# Altium project copper_suicide.PrjPCB (part 4 of 5)

## Sheet con-left-top.SchDoc: CS - Left Top
size Letter; CheckedBy: J. Brinton; CompanyName: Signal Laboratories, Inc.; DrawnBy: J. Brinton; Engineer: J. Brinton; Address1: 3479 Edison Way; Address2: Menlo Park CA 94025; Address3: +1 (877) 778-8435; Address4: siglabs.com; Revision: 3; SheetNumber: 33; SheetTotal: 47
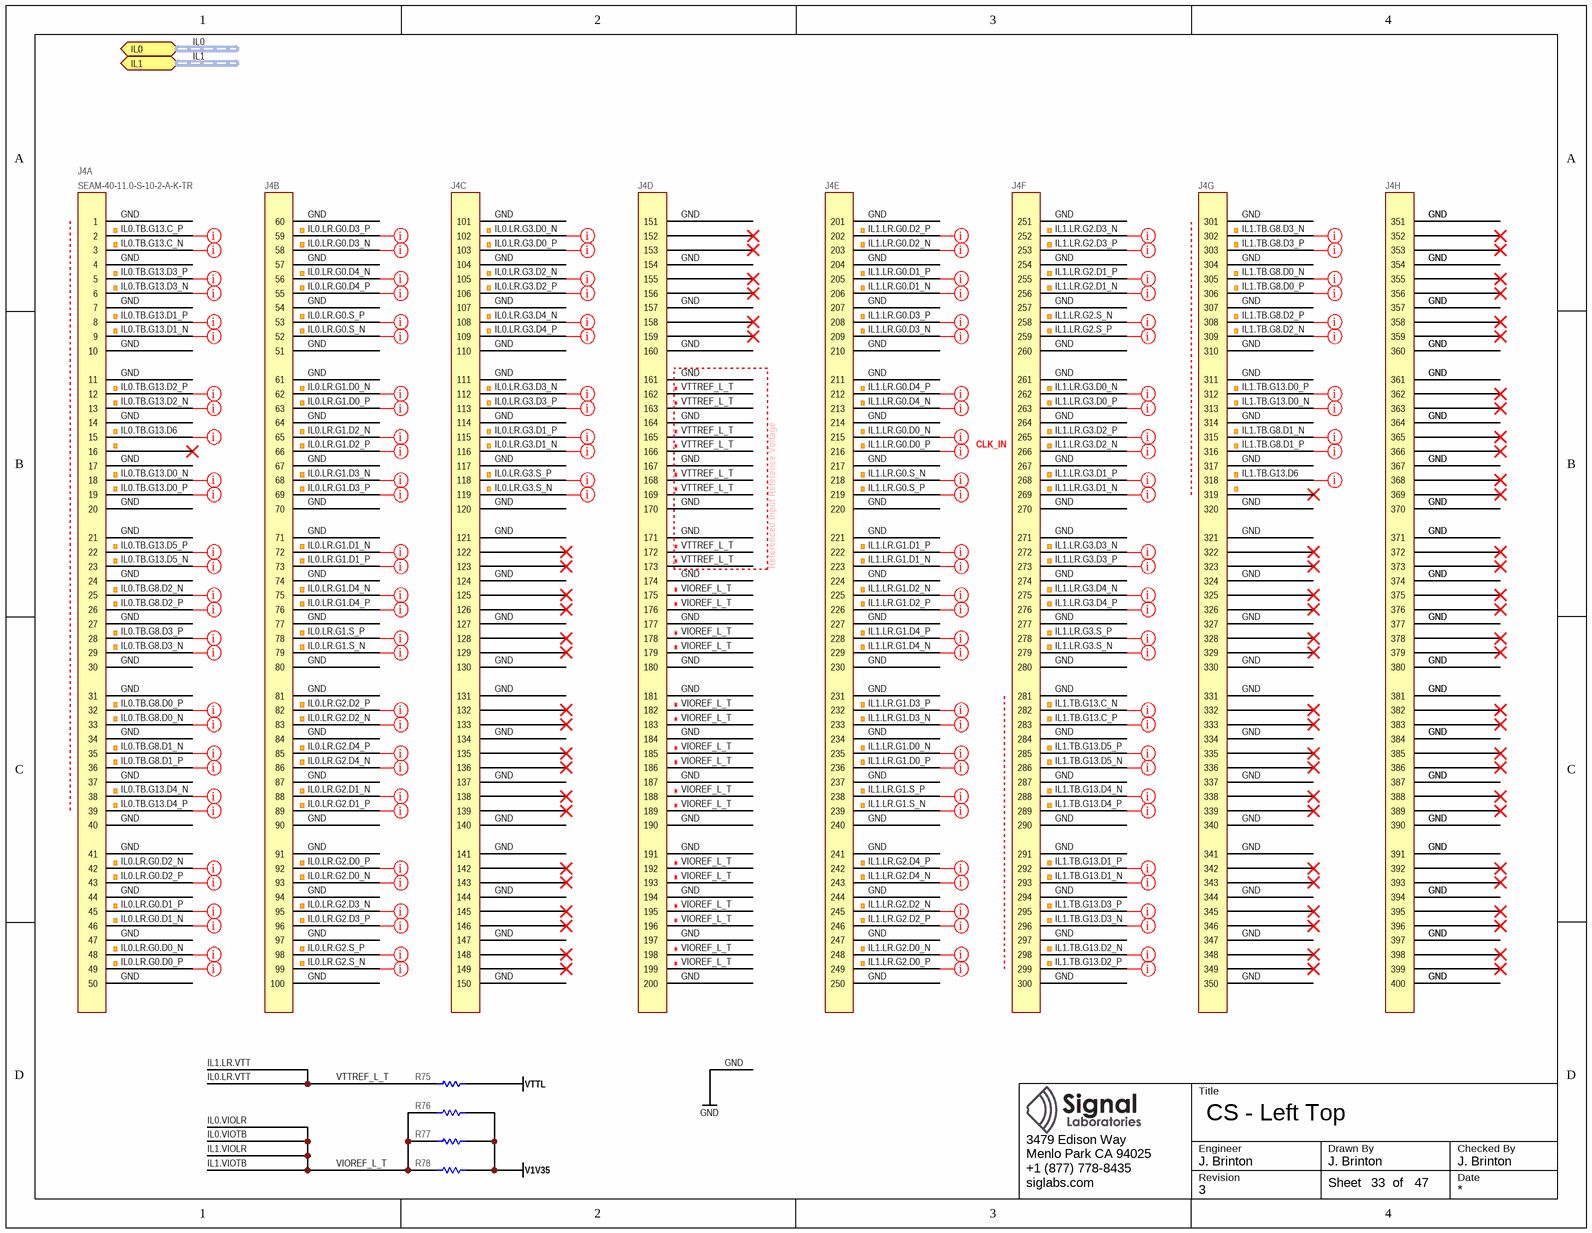
[diagram p18: con-left-top.SchDoc]

### Parts
J4  SEAM-40-11.0-S-10-2-A-K-TR  [SEAM-40-11.0-S-10-2-A-K-TR]  (parts A,B,C,D,E,F,G,H of 8)
R75  SOLDER_LINK  [SOLDERLINK0603X26N]  (value not drawn)  (no BOM)
R76  SOLDER_LINK  [SOLDERLINK0603X26N]  (value not drawn)  (no BOM)
R77  SOLDER_LINK  [SOLDERLINK0603X26N]  (value not drawn)  (no BOM)
R78  SOLDER_LINK  [SOLDERLINK0603X26N]  (value not drawn)  (no BOM)

### Ports
IL0 (harness IL), IL1 (harness IL)

### Nets
GND: J4.1 J4.4 J4.7 J4.10 J4.11 J4.14 J4.17 J4.20 J4.21 J4.24 J4.27 J4.30 J4.31 J4.34 J4.37 J4.40 J4.41 J4.44 J4.47 J4.50 J4.51 J4.54 J4.57 J4.60 J4.61 J4.64 J4.67 J4.70 J4.71 J4.74 J4.77 J4.80 J4.81 J4.84 J4.87 J4.90 J4.91 J4.94 J4.97 J4.100 J4.101 J4.104 J4.107 J4.110 J4.111 J4.114 J4.117 J4.120 J4.121 J4.124 J4.127 J4.130 J4.131 J4.134 J4.137 J4.140 J4.141 J4.144 J4.147 J4.150 J4.151 J4.154 J4.157 J4.160 J4.161 J4.164 J4.167 J4.170 J4.171 J4.174 J4.177 J4.180 J4.181 J4.184 J4.187 J4.190 J4.191 J4.194 J4.197 J4.200 J4.201 J4.204 J4.207 J4.210 J4.211 J4.214 J4.217 J4.220 J4.221 J4.224 J4.227 J4.230 J4.231 J4.234 J4.237 J4.240 J4.241 J4.244 J4.247 J4.250 J4.251 J4.254 J4.257 J4.260 J4.261 J4.264 J4.267 J4.270 J4.271 J4.274 J4.277 J4.280 J4.281 J4.284 J4.287 J4.290 J4.291 J4.294 J4.297 J4.300 J4.301 J4.304 J4.307 J4.310 J4.311 J4.314 J4.317 J4.320 J4.321 J4.324 J4.327 J4.330 J4.331 J4.334 J4.337 J4.340 J4.341 J4.344 J4.347 J4.350 J4.351 J4.354 J4.357 J4.360 J4.361 J4.364 J4.367 J4.370 J4.371 J4.374 J4.377 J4.380 J4.381 J4.384 J4.387 J4.390 J4.391 J4.394 J4.397 J4.400
V1V35: R76.1 R77.1 R78.1
VTTL: R75.1
IL0.LR.G0.D0_N: J4.48
IL0.LR.G0.D0_P: J4.49
IL0.LR.G0.D1_N: J4.46
IL0.LR.G0.D1_P: J4.45
IL0.LR.G0.D2_N: J4.42
IL0.LR.G0.D2_P: J4.43
IL0.LR.G0.D3_N: J4.58
IL0.LR.G0.D3_P: J4.59
IL0.LR.G0.D4_N: J4.56
IL0.LR.G0.D4_P: J4.55
IL0.LR.G0.S_N: J4.52
IL0.LR.G0.S_P: J4.53
IL0.LR.G1.D0_N: J4.62
IL0.LR.G1.D0_P: J4.63
IL0.LR.G1.D1_N: J4.72
IL0.LR.G1.D1_P: J4.73
IL0.LR.G1.D2_N: J4.65
IL0.LR.G1.D2_P: J4.66
IL0.LR.G1.D3_N: J4.68
IL0.LR.G1.D3_P: J4.69
IL0.LR.G1.D4_N: J4.75
IL0.LR.G1.D4_P: J4.76
IL0.LR.G1.S_N: J4.79
IL0.LR.G1.S_P: J4.78
IL0.LR.G2.D0_N: J4.93
IL0.LR.G2.D0_P: J4.92
IL0.LR.G2.D1_N: J4.88
IL0.LR.G2.D1_P: J4.89
IL0.LR.G2.D2_N: J4.83
IL0.LR.G2.D2_P: J4.82
IL0.LR.G2.D3_N: J4.95
IL0.LR.G2.D3_P: J4.96
IL0.LR.G2.D4_N: J4.86
IL0.LR.G2.D4_P: J4.85
IL0.LR.G2.S_N: J4.99
IL0.LR.G2.S_P: J4.98
IL0.LR.G3.D0_N: J4.102
IL0.LR.G3.D0_P: J4.103
IL0.LR.G3.D1_N: J4.116
IL0.LR.G3.D1_P: J4.115
IL0.LR.G3.D2_N: J4.105
IL0.LR.G3.D2_P: J4.106
IL0.LR.G3.D3_N: J4.112
IL0.LR.G3.D3_P: J4.113
IL0.LR.G3.D4_N: J4.108
IL0.LR.G3.D4_P: J4.109
IL0.LR.G3.S_N: J4.119
IL0.LR.G3.S_P: J4.118
IL0.LR.VTT: J4.162 J4.163 J4.165 J4.166 J4.168 J4.169 J4.172 J4.173 R75.2  [also labelled IL1.LR.VTT, VTTREF_L_T]
IL0.TB.G8.D0_N: J4.33
IL0.TB.G8.D0_P: J4.32
IL0.TB.G8.D1_N: J4.35
IL0.TB.G8.D1_P: J4.36
IL0.TB.G8.D2_N: J4.25
IL0.TB.G8.D2_P: J4.26
IL0.TB.G8.D3_N: J4.29
IL0.TB.G8.D3_P: J4.28
IL0.TB.G13.C_N: J4.3
IL0.TB.G13.C_P: J4.2
IL0.TB.G13.D0_N: J4.18
IL0.TB.G13.D0_P: J4.19
IL0.TB.G13.D1_N: J4.9
IL0.TB.G13.D1_P: J4.8
IL0.TB.G13.D2_N: J4.13
IL0.TB.G13.D2_P: J4.12
IL0.TB.G13.D3_N: J4.6
IL0.TB.G13.D3_P: J4.5
IL0.TB.G13.D4_N: J4.38
IL0.TB.G13.D4_P: J4.39
IL0.TB.G13.D5_N: J4.23
IL0.TB.G13.D5_P: J4.22
IL0.TB.G13.D6: J4.15
IL0.VIOLR: J4.175 J4.176 J4.178 J4.179 J4.182 J4.183 J4.185 J4.186 J4.188 J4.189 J4.192 J4.193 J4.195 J4.196 J4.198 J4.199 R76.2 R77.2 R78.2  [also labelled IL0.VIOTB, IL1.VIOLR, IL1.VIOTB, VIOREF_L_T]
IL1.LR.G0.D0_N: J4.215
IL1.LR.G0.D0_P: J4.216
IL1.LR.G0.D1_N: J4.206
IL1.LR.G0.D1_P: J4.205
IL1.LR.G0.D2_N: J4.203
IL1.LR.G0.D2_P: J4.202
IL1.LR.G0.D3_N: J4.209
IL1.LR.G0.D3_P: J4.208
IL1.LR.G0.D4_N: J4.213
IL1.LR.G0.D4_P: J4.212
IL1.LR.G0.S_N: J4.218
IL1.LR.G0.S_P: J4.219
IL1.LR.G1.D0_N: J4.235
IL1.LR.G1.D0_P: J4.236
IL1.LR.G1.D1_N: J4.223
IL1.LR.G1.D1_P: J4.222
IL1.LR.G1.D2_N: J4.225
IL1.LR.G1.D2_P: J4.226
IL1.LR.G1.D3_N: J4.233
IL1.LR.G1.D3_P: J4.232
IL1.LR.G1.D4_N: J4.229
IL1.LR.G1.D4_P: J4.228
IL1.LR.G1.S_N: J4.239
IL1.LR.G1.S_P: J4.238
IL1.LR.G2.D0_N: J4.248
IL1.LR.G2.D0_P: J4.249
IL1.LR.G2.D1_N: J4.256
IL1.LR.G2.D1_P: J4.255
IL1.LR.G2.D2_N: J4.245
IL1.LR.G2.D2_P: J4.246
IL1.LR.G2.D3_N: J4.252
IL1.LR.G2.D3_P: J4.253
IL1.LR.G2.D4_N: J4.243
IL1.LR.G2.D4_P: J4.242
IL1.LR.G2.S_N: J4.258
IL1.LR.G2.S_P: J4.259
IL1.LR.G3.D0_N: J4.262
IL1.LR.G3.D0_P: J4.263
IL1.LR.G3.D1_N: J4.269
IL1.LR.G3.D1_P: J4.268
IL1.LR.G3.D2_N: J4.266
IL1.LR.G3.D2_P: J4.265
IL1.LR.G3.D3_N: J4.272
IL1.LR.G3.D3_P: J4.273
IL1.LR.G3.D4_N: J4.275
IL1.LR.G3.D4_P: J4.276
IL1.LR.G3.S_N: J4.279
IL1.LR.G3.S_P: J4.278
IL1.TB.G8.D0_N: J4.305
IL1.TB.G8.D0_P: J4.306
IL1.TB.G8.D1_N: J4.315
IL1.TB.G8.D1_P: J4.316
IL1.TB.G8.D2_N: J4.309
IL1.TB.G8.D2_P: J4.308
IL1.TB.G8.D3_N: J4.302
IL1.TB.G8.D3_P: J4.303
IL1.TB.G13.C_N: J4.282
IL1.TB.G13.C_P: J4.283
IL1.TB.G13.D0_N: J4.313
IL1.TB.G13.D0_P: J4.312
IL1.TB.G13.D1_N: J4.293
IL1.TB.G13.D1_P: J4.292
IL1.TB.G13.D2_N: J4.298
IL1.TB.G13.D2_P: J4.299
IL1.TB.G13.D3_N: J4.296
IL1.TB.G13.D3_P: J4.295
IL1.TB.G13.D4_N: J4.288
IL1.TB.G13.D4_P: J4.289
IL1.TB.G13.D5_N: J4.286
IL1.TB.G13.D5_P: J4.285
IL1.TB.G13.D6: J4.318

Not connected (* = marked no-connect by the designer): J4 16* 122* 123* 125* 126* 128* 129* 132* 133* 135* 136* 138* 139* 142* 143* 145* 146* 148* 149* 152* 153* 155* 156* 158* 159* 319* 322* 323* 325* 326* 328* 329* 332* 333* 335* 336* 338* 339* 342* 343* 345* 346* 348* 349* 352* 353* 355* 356* 358* 359* 362* 363* 365* 366* 368* 369* 372* 373* 375* 376* 378* 379* 382* 383* 385* 386* 388* 389* 392* 393* 395* 396* 398* 399*

### Buses and harness runs
harness IL0 = port IL0
harness IL1 = port IL1

### Layout directives
net class z50; differential pair; net class loose: IL0.LR.G0.D0_N, IL0.LR.G0.D0_P, IL0.LR.G0.D1_N, IL0.LR.G0.D1_P, IL0.LR.G0.D2_N, IL0.LR.G0.D2_P, IL0.LR.G0.D3_N, IL0.LR.G0.D3_P, IL0.LR.G0.D4_N, IL0.LR.G0.D4_P, IL0.LR.G0.S_N, IL0.LR.G0.S_P, IL0.LR.G1.D0_N, IL0.LR.G1.D0_P, IL0.LR.G1.D1_N, IL0.LR.G1.D1_P, IL0.LR.G1.D2_N, IL0.LR.G1.D2_P, IL0.LR.G1.D3_N, IL0.LR.G1.D3_P, IL0.LR.G1.D4_N, IL0.LR.G1.D4_P, IL0.LR.G1.S_N, IL0.LR.G1.S_P, IL0.LR.G2.D0_N, IL0.LR.G2.D0_P, IL0.LR.G2.D1_N, IL0.LR.G2.D1_P, IL0.LR.G2.D2_N, IL0.LR.G2.D2_P, IL0.LR.G2.D3_N, IL0.LR.G2.D3_P, IL0.LR.G2.D4_N, IL0.LR.G2.D4_P, IL0.LR.G2.S_N, IL0.LR.G2.S_P, IL0.LR.G3.D0_N, IL0.LR.G3.D0_P, IL0.LR.G3.D1_N, IL0.LR.G3.D1_P, IL0.LR.G3.D2_N, IL0.LR.G3.D2_P, IL0.LR.G3.D3_N, IL0.LR.G3.D3_P, IL0.LR.G3.D4_N, IL0.LR.G3.D4_P, IL0.LR.G3.S_N, IL0.LR.G3.S_P, IL0.TB.G8.D0_N, IL0.TB.G8.D0_P, IL0.TB.G8.D1_N, IL0.TB.G8.D1_P, IL0.TB.G8.D2_N, IL0.TB.G8.D2_P, IL0.TB.G8.D3_N, IL0.TB.G8.D3_P, IL0.TB.G13.C_N, IL0.TB.G13.C_P, IL0.TB.G13.D0_N, IL0.TB.G13.D0_P, IL0.TB.G13.D1_N, IL0.TB.G13.D1_P, IL0.TB.G13.D2_N, IL0.TB.G13.D2_P, IL0.TB.G13.D3_N, IL0.TB.G13.D3_P, IL0.TB.G13.D4_N, IL0.TB.G13.D4_P, IL0.TB.G13.D5_N, IL0.TB.G13.D5_P, IL1.LR.G0.D0_N, IL1.LR.G0.D0_P, IL1.LR.G0.D1_N, IL1.LR.G0.D1_P, IL1.LR.G0.D2_N, IL1.LR.G0.D2_P, IL1.LR.G0.D3_N, IL1.LR.G0.D3_P, IL1.LR.G0.D4_N, IL1.LR.G0.D4_P, IL1.LR.G0.S_N, IL1.LR.G0.S_P, IL1.LR.G1.D0_N, IL1.LR.G1.D0_P, IL1.LR.G1.D1_N, IL1.LR.G1.D1_P, IL1.LR.G1.D2_N, IL1.LR.G1.D2_P, IL1.LR.G1.D3_N, IL1.LR.G1.D3_P, IL1.LR.G1.D4_N, IL1.LR.G1.D4_P, IL1.LR.G1.S_N, IL1.LR.G1.S_P, IL1.LR.G2.D0_N, IL1.LR.G2.D0_P, IL1.LR.G2.D1_N, IL1.LR.G2.D1_P, IL1.LR.G2.D2_N, IL1.LR.G2.D2_P, IL1.LR.G2.D3_N, IL1.LR.G2.D3_P, IL1.LR.G2.D4_N, IL1.LR.G2.D4_P, IL1.LR.G2.S_N, IL1.LR.G2.S_P, IL1.LR.G3.D0_N, IL1.LR.G3.D0_P, IL1.LR.G3.D1_N, IL1.LR.G3.D1_P, IL1.LR.G3.D2_N, IL1.LR.G3.D2_P, IL1.LR.G3.D3_N, IL1.LR.G3.D3_P, IL1.LR.G3.D4_N, IL1.LR.G3.D4_P, IL1.LR.G3.S_N, IL1.LR.G3.S_P, IL1.TB.G8.D0_N, IL1.TB.G8.D0_P, IL1.TB.G8.D1_N, IL1.TB.G8.D1_P, IL1.TB.G8.D2_N, IL1.TB.G8.D2_P, IL1.TB.G8.D3_N, IL1.TB.G8.D3_P, IL1.TB.G13.C_N, IL1.TB.G13.C_P, IL1.TB.G13.D0_N, IL1.TB.G13.D0_P, IL1.TB.G13.D1_N, IL1.TB.G13.D1_P, IL1.TB.G13.D2_N, IL1.TB.G13.D2_P, IL1.TB.G13.D3_N, IL1.TB.G13.D3_P, IL1.TB.G13.D4_N, IL1.TB.G13.D4_P, IL1.TB.G13.D5_N, IL1.TB.G13.D5_P
net class z50: IL0.TB.G13.D6, IL1.TB.G13.D6

### Notes on the sheet
- (near J4) CLK_IN
- Referenced Input Reference Voltage
- Title
- Engineer
- Revision
- Drawn By
- Checked By
- Date
- Sheet
- of

### Library data of the parts
J4 = SEAM-40-11.0-S-10-2-A-K-TR: Terminal Array Assembly, Surface Mount, 0.050" Pitch, 400 Pins; Manufacturer: Samtec; Manufacturer P/N: SEAM-40-11.0-S-10-2-A-K-TR
R75-R78 = RES: Solder Link; Manufacturer P/N: *; Manufacturer: *

## Sheet config.SchDoc: Copper Suicide - Config Options
size Letter; CheckedBy: J. Brinton; CompanyName: Signal Laboratories, Inc.; DrawnBy: J. Brinton; Engineer: J. Brinton; Address1: 3479 Edison Way; Address2: Menlo Park CA 94025; Address3: +1 (877) 778-8435; Address4: siglabs.com; Revision: 3; SheetNumber: 22; SheetTotal: 47
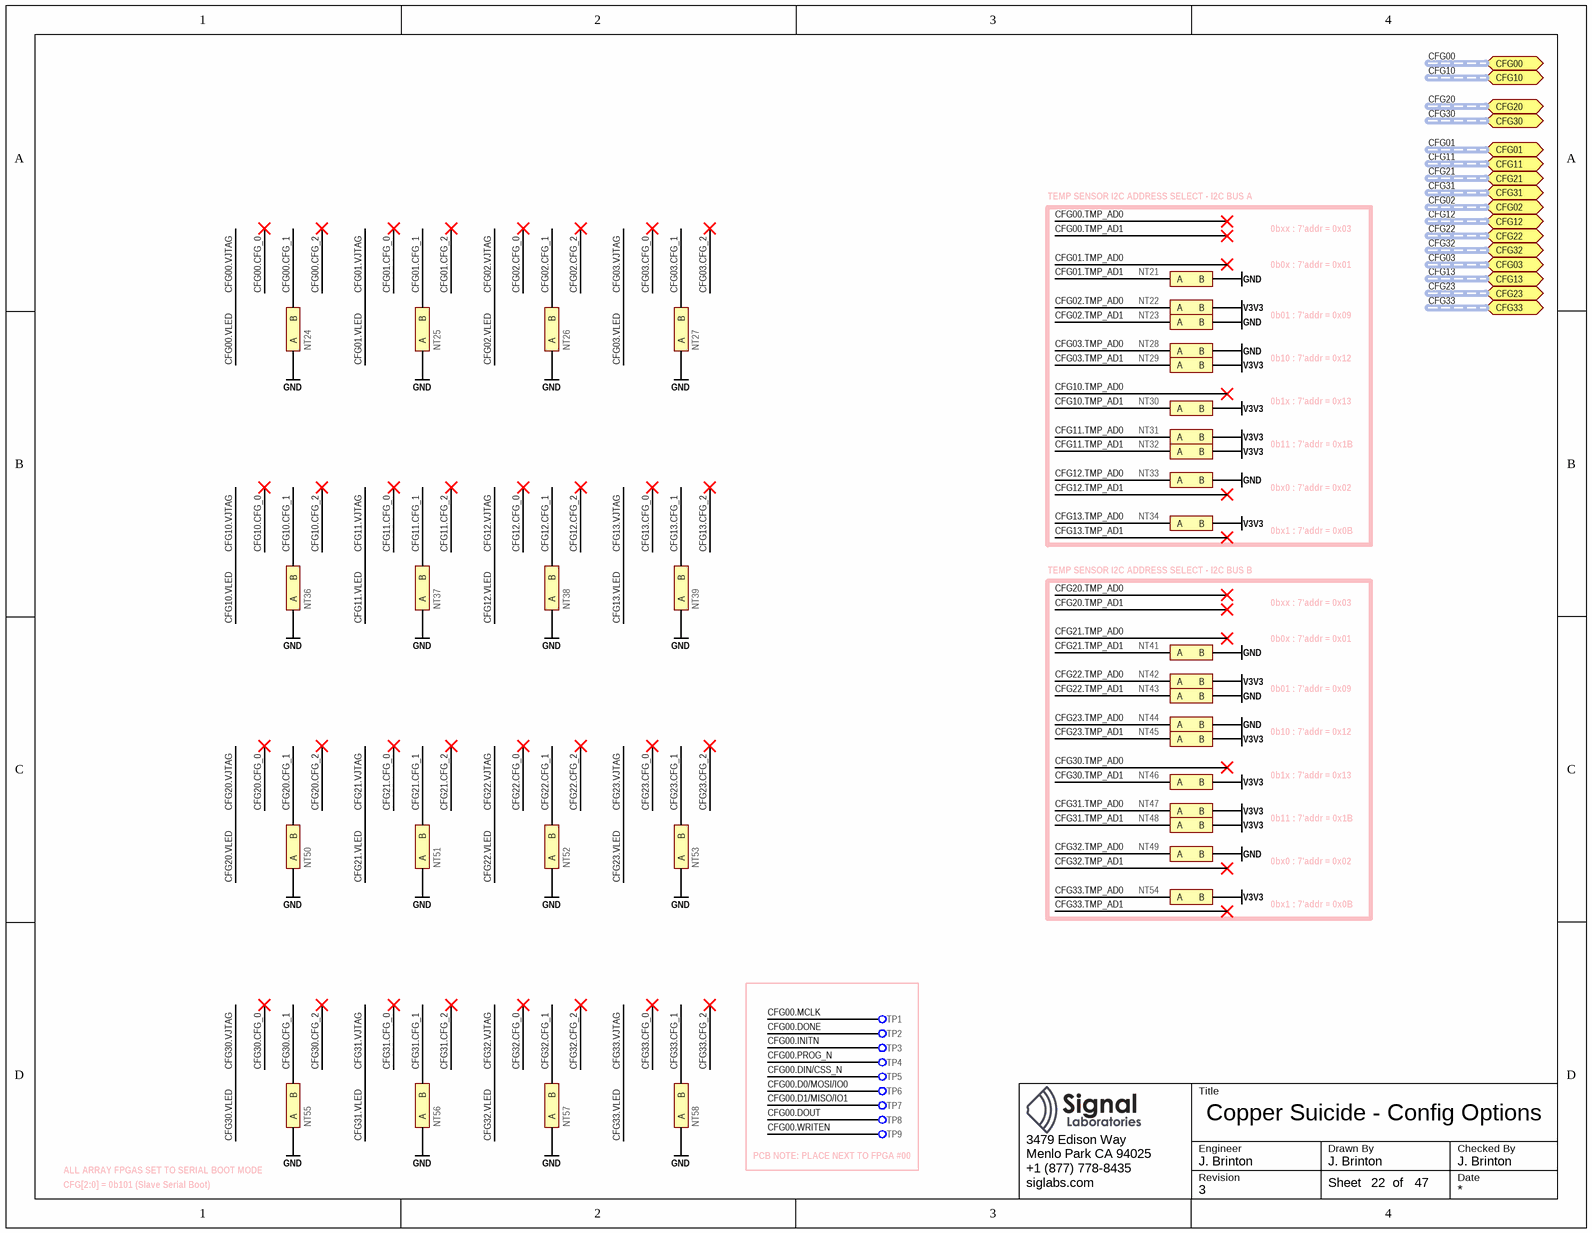
[diagram p19: config.SchDoc]

### Parts
NT21  NET_TIE  [NET_TIE]  (value not drawn)  (net tie, no BOM)
NT22  NET_TIE  [NET_TIE]  (value not drawn)  (net tie, no BOM)
NT23  NET_TIE  [NET_TIE]  (value not drawn)  (net tie, no BOM)
NT24  NET_TIE  [NET_TIE_400]  (value not drawn)  (net tie, no BOM)
NT25  NET_TIE  [NET_TIE_400]  (value not drawn)  (net tie, no BOM)
NT26  NET_TIE  [NET_TIE_400]  (value not drawn)  (net tie, no BOM)
NT27  NET_TIE  [NET_TIE_400]  (value not drawn)  (net tie, no BOM)
NT28  NET_TIE  [NET_TIE]  (value not drawn)  (net tie, no BOM)
NT29  NET_TIE  [NET_TIE]  (value not drawn)  (net tie, no BOM)
NT30  NET_TIE  [NET_TIE]  (value not drawn)  (net tie, no BOM)
NT31  NET_TIE  [NET_TIE]  (value not drawn)  (net tie, no BOM)
NT32  NET_TIE  [NET_TIE]  (value not drawn)  (net tie, no BOM)
NT33  NET_TIE  [NET_TIE]  (value not drawn)  (net tie, no BOM)
NT34  NET_TIE  [NET_TIE]  (value not drawn)  (net tie, no BOM)
NT36  NET_TIE  [NET_TIE_400]  (value not drawn)  (net tie, no BOM)
NT37  NET_TIE  [NET_TIE_400]  (value not drawn)  (net tie, no BOM)
NT38  NET_TIE  [NET_TIE_400]  (value not drawn)  (net tie, no BOM)
NT39  NET_TIE  [NET_TIE_400]  (value not drawn)  (net tie, no BOM)
NT41  NET_TIE  [NET_TIE]  (value not drawn)  (net tie, no BOM)
NT42  NET_TIE  [NET_TIE]  (value not drawn)  (net tie, no BOM)
NT43  NET_TIE  [NET_TIE]  (value not drawn)  (net tie, no BOM)
NT44  NET_TIE  [NET_TIE]  (value not drawn)  (net tie, no BOM)
NT45  NET_TIE  [NET_TIE]  (value not drawn)  (net tie, no BOM)
NT46  NET_TIE  [NET_TIE]  (value not drawn)  (net tie, no BOM)
NT47  NET_TIE  [NET_TIE]  (value not drawn)  (net tie, no BOM)
NT48  NET_TIE  [NET_TIE]  (value not drawn)  (net tie, no BOM)
NT49  NET_TIE  [NET_TIE]  (value not drawn)  (net tie, no BOM)
NT50  NET_TIE  [NET_TIE_400]  (value not drawn)  (net tie, no BOM)
NT51  NET_TIE  [NET_TIE_400]  (value not drawn)  (net tie, no BOM)
NT52  NET_TIE  [NET_TIE_400]  (value not drawn)  (net tie, no BOM)
NT53  NET_TIE  [NET_TIE_400]  (value not drawn)  (net tie, no BOM)
NT54  NET_TIE  [NET_TIE]  (value not drawn)  (net tie, no BOM)
NT55  NET_TIE  [NET_TIE_400]  (value not drawn)  (net tie, no BOM)
NT56  NET_TIE  [NET_TIE_400]  (value not drawn)  (net tie, no BOM)
NT57  NET_TIE  [NET_TIE_400]  (value not drawn)  (net tie, no BOM)
NT58  NET_TIE  [NET_TIE_400]  (value not drawn)  (net tie, no BOM)
TP1  5000  [TEST_POINT_SMD_10]  (value not drawn)  (no BOM)
TP2  5000  [TEST_POINT_SMD_10]  (value not drawn)  (no BOM)
TP3  5000  [TEST_POINT_SMD_10]  (value not drawn)  (no BOM)
TP4  5000  [TEST_POINT_SMD_10]  (value not drawn)  (no BOM)
TP5  5000  [TEST_POINT_SMD_10]  (value not drawn)  (no BOM)
TP6  5000  [TEST_POINT_SMD_10]  (value not drawn)  (no BOM)
TP7  5000  [TEST_POINT_SMD_10]  (value not drawn)  (no BOM)
TP8  5000  [TEST_POINT_SMD_10]  (value not drawn)  (no BOM)
TP9  5000  [TEST_POINT_SMD_10]  (value not drawn)  (no BOM)

### Blocks framed on the sheet
PCB NOTE: PLACE NEXT TO FPGA #00: TP1-TP9

### Ports
CFG00 (harness CFG), CFG01 (harness CFG), CFG02 (harness CFG), CFG03 (harness CFG), CFG10 (harness CFG), CFG11 (harness CFG), CFG12 (harness CFG), CFG13 (harness CFG), CFG20 (harness CFG), CFG21 (harness CFG), CFG22 (harness CFG), CFG23 (harness CFG), CFG30 (harness CFG), CFG31 (harness CFG), CFG32 (harness CFG), CFG33 (harness CFG)

### Nets
GND: NT21.B NT23.B NT24.A NT25.A NT26.A NT27.A NT28.B NT33.B NT36.A NT37.A NT38.A NT39.A NT41.B NT43.B NT44.B NT49.B NT50.A NT51.A NT52.A NT53.A NT55.A NT56.A NT57.A NT58.A
V3V3: NT22.B NT29.B NT30.B NT31.B NT32.B NT34.B NT42.B NT45.B NT46.B NT47.B NT48.B NT54.B
CFG00.CFG_1: NT24.B
CFG00.D0/MOSI/IO0: TP6.1
CFG00.D1/MISO/IO1: TP7.1
CFG00.DIN/CSS_N: TP5.1
CFG00.DONE: TP2.1
CFG00.DOUT: TP8.1
CFG00.INITN: TP3.1
CFG00.MCLK: TP1.1
CFG00.PROG_N: TP4.1
CFG00.WRITEN: TP9.1
CFG01.CFG_1: NT25.B
CFG01.TMP_AD1: NT21.A
CFG02.CFG_1: NT26.B
CFG02.TMP_AD0: NT22.A
CFG02.TMP_AD1: NT23.A
CFG03.CFG_1: NT27.B
CFG03.TMP_AD0: NT28.A
CFG03.TMP_AD1: NT29.A
CFG10.CFG_1: NT36.B
CFG10.TMP_AD1: NT30.A
CFG11.CFG_1: NT37.B
CFG11.TMP_AD0: NT31.A
CFG11.TMP_AD1: NT32.A
CFG12.CFG_1: NT38.B
CFG12.TMP_AD0: NT33.A
CFG13.CFG_1: NT39.B
CFG13.TMP_AD0: NT34.A
CFG20.CFG_1: NT50.B
CFG21.CFG_1: NT51.B
CFG21.TMP_AD1: NT41.A
CFG22.CFG_1: NT52.B
CFG22.TMP_AD0: NT42.A
CFG22.TMP_AD1: NT43.A
CFG23.CFG_1: NT53.B
CFG23.TMP_AD0: NT44.A
CFG23.TMP_AD1: NT45.A
CFG30.CFG_1: NT55.B
CFG30.TMP_AD1: NT46.A
CFG31.CFG_1: NT56.B
CFG31.TMP_AD0: NT47.A
CFG31.TMP_AD1: NT48.A
CFG32.CFG_1: NT57.B
CFG32.TMP_AD0: NT49.A
CFG33.CFG_1: NT58.B
CFG33.TMP_AD0: NT54.A

### Buses and harness runs
harness CFG00 = port CFG00
harness CFG01 = port CFG01
harness CFG02 = port CFG02
harness CFG03 = port CFG03
harness CFG10 = port CFG10
harness CFG11 = port CFG11
harness CFG12 = port CFG12
harness CFG13 = port CFG13
harness CFG20 = port CFG20
harness CFG21 = port CFG21
harness CFG22 = port CFG22
harness CFG23 = port CFG23
harness CFG30 = port CFG30
harness CFG31 = port CFG31
harness CFG32 = port CFG32
harness CFG33 = port CFG33

### Notes on the sheet
- TEMP SENSOR I2C ADDRESS SELECT - I2C BUS A
- 0bxx : 7'addr = 0x03
- 0b0x : 7'addr = 0x01
- 0b01 : 7'addr = 0x09
- 0b10 : 7'addr = 0x12
- 0b1x : 7'addr = 0x13
- 0b11 : 7'addr = 0x1B
- 0bx0 : 7'addr = 0x02
- 0bx1 : 7'addr = 0x0B
- (near NT34) TEMP SENSOR I2C ADDRESS SELECT - I2C BUS B
- (near NT55) ALL ARRAY FPGAS SET TO SERIAL BOOT MODE
- CFG[2:0] = 0b101 (Slave Serial Boot)
- Title
- Engineer
- Revision
- Drawn By
- Checked By
- Date
- Sheet
- of

### Library data of the parts
TP1-TP9 = TEST_POINT: Thruhole Miniature Test Point; Manufacturer: Keystone Electronics Corp; Manufacturer P/N: 5000; Do Not Place: *

## Sheet flash.SchDoc: Copper Suicide - Flash
size Letter; CheckedBy: J. Brinton; CompanyName: Signal Laboratories, Inc.; DrawnBy: J. Brinton; Engineer: J. Brinton; Address1: 3479 Edison Way; Address2: Menlo Park CA 94025; Address3: +1 (877) 778-8435; Address4: siglabs.com; Revision: 3; SheetNumber: 24; SheetTotal: 47
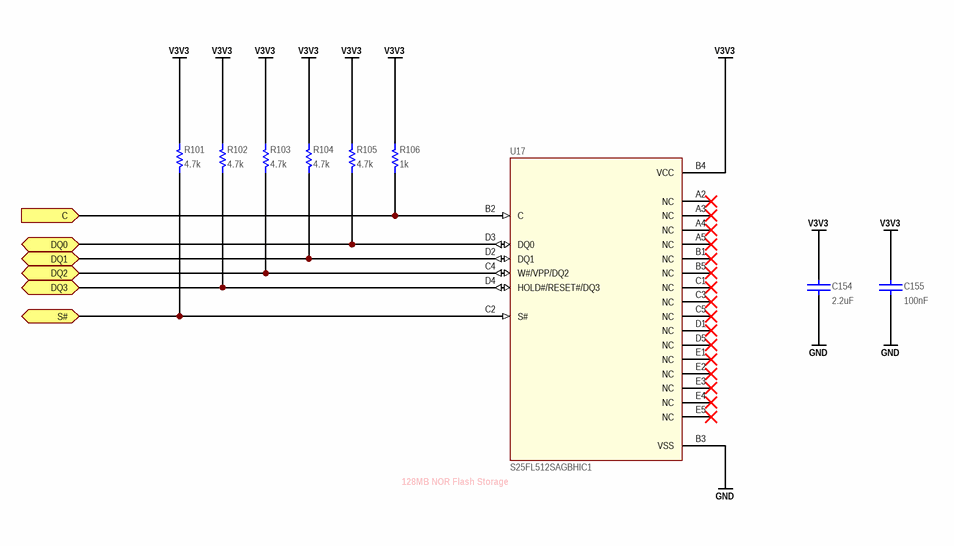
[diagram p20: flash.SchDoc]

### Parts
C154  value 2.2uF  [CAPC160X80X90L20N]  (hidden comment: C1608X7R1A225M080)
C155  value 100nF  [CAPC100X50X55L25N]  (hidden comment: GCM155R71H104KE02)
R101  value 4.7k  [RESC1005X40N]  (hidden comment: ERJ-2RKF4701X)
R102  value 4.7k  [RESC1005X40N]  (hidden comment: ERJ-2RKF4701X)
R103  value 4.7k  [RESC1005X40N]  (hidden comment: ERJ-2RKF4701X)
R104  value 4.7k  [RESC1005X40N]  (hidden comment: ERJ-2RKF4701X)
R105  value 4.7k  [RESC1005X40N]  (hidden comment: ERJ-2RKF4701X)
R106  value 1k  [RESC1005X40N]  (hidden comment: ERJ-2RKF1001X)
U17  S25FL512SAGBHIC1  [L-PBGA-24]

### Ports
C (in), DQ0 (bidir), DQ1 (bidir), DQ2 (bidir), DQ3 (bidir), S# (bidir)

### Nets
GND: C154.1 C155.1 U17.B3(VSS)
V3V3: C154.2 C155.2 R101.2 R102.2 R103.2 R104.2 R105.2 R106.2 U17.B4(VCC)
C: R106.1 U17.B2(C) ; port C
DQ0: R105.1 U17.D3(DQ0) ; port DQ0
DQ1: R104.1 U17.D2(DQ1) ; port DQ1
DQ2: R103.1 U17.C4(W#/VPP/DQ2) ; port DQ2
DQ3: R102.1 U17.D4(HOLD#/RESET#/DQ3) ; port DQ3
S#: R101.1 U17.C2(S#) ; port S#

Not connected (* = marked no-connect by the designer): U17 A2(NC)* A3(NC)* A4(NC)* A5(NC)* B1(NC)* B5(NC)* C1(NC)* C3(NC)* C5(NC)* D1(NC)* D5(NC)* E1(NC)* E2(NC)* E3(NC)* E4(NC)* E5(NC)*

### Notes on the sheet
- (near U17) 128MB NOR Flash Storage
- Title
- Engineer
- Revision
- Drawn By
- Checked By
- Date
- Sheet
- of

### Library data of the parts
C154 = CAP: Ceramic Capacitor 2.2uF ±20% 10V X7R 0603; Manufacturer: TDK; Tr: -55:125; Manufacturer P/N: C1608X7R1A225M080; Tolerance: ±20%; Voltage: 10V; Footprint: *; Package: 0603
C155 = CAP: Ceramic Capacitor 100nF ±10% 50V X7R 0402; Manufacturer: Murata; Tr: -55:125; Manufacturer P/N: GCM155R71H104KE02; Tolerance: ±10%; Voltage: 50V; Footprint: *; Package: 0402
R101-R105 = RES: Thick Film Resistor 4.7k ±1% 0.1W 75V 0402; Manufacturer: Panasonic; Tcr: ±100; Tr: -55:155; Voltage: 75; Power: 0.1; Tolerance: ±1%; Manufacturer P/N: ERJ-2RKF4701X; Alternatives: *; Footprint: *; Package: 0402
R106 = RES: Thick Film Resistor 1k ±1% 0.1W 50V 0402; Manufacturer: Panasonic; Tcr: ±100; Tr: -55:155; Voltage: 50; Power: 0.1; Tolerance: ±1%; Manufacturer P/N: ERJ-2RKF1001X; Alternatives: *; Footprint: *; Package: 0402
U17 = N25Q00AA13G1240: 1024Mb, 3.3V Serial Flash Memory LBGA24; Manufacturer: Cypress; Manufacturer P/N: S25FL512SAGBHIC1

## Sheet fans.SchDoc: Copper Suicide - Fan Switch
size Letter; CheckedBy: J. Brinton; CompanyName: Signal Laboratories, Inc.; DrawnBy: J. Brinton; Engineer: J. Brinton; Address1: 3479 Edison Way; Address2: Menlo Park CA 94025; Address3: +1 (877) 778-8435; Address4: siglabs.com; Revision: 3; SheetNumber: 46; SheetTotal: 47
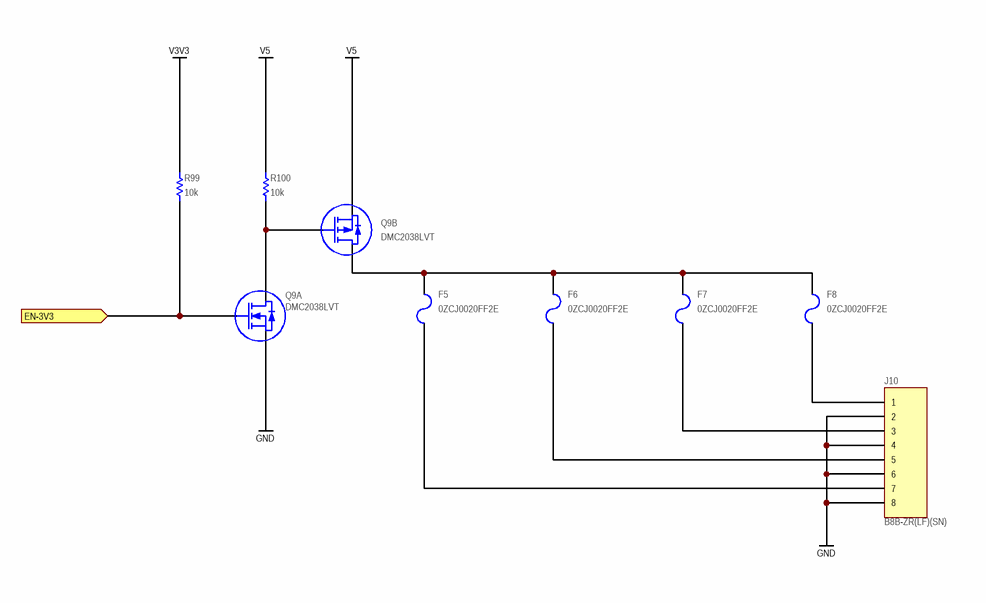
[diagram p21: fans.SchDoc]

### Parts
F5  0ZCJ0020FF2E  [1206]
F6  0ZCJ0020FF2E  [1206]
F7  0ZCJ0020FF2E  [1206]
F8  0ZCJ0020FF2E  [1206]
J10  B8B-ZR(LF)(SN)  [B8B-ZR]
Q9  DMC2038LVT  [TSOP-6]  (parts A,B of 2)
R99  value 10k  [RESC1005X40N]  (hidden comment: ERJ-2RKF1002X)
R100  value 10k  [RESC1005X40N]  (hidden comment: ERJ-2RKF1002X)

### Ports
EN-3V3 (in)

### Nets
GND: J10.2 J10.4 J10.6 J10.8 Q9.5(S)
V3V3: R99.2
V5: Q9.2(S) R100.2
EN-3V3: Q9.1(G) R99.1 ; port EN-3V3
NetF5_1: F5.1 F6.1 F7.1 F8.1 Q9.4(D)
NetF5_2: F5.2 J10.7
NetF6_2: F6.2 J10.5
NetF7_2: F7.2 J10.3
NetF8_2: F8.2 J10.1
NetQ9_3: Q9.3(G) Q9.6(D) R100.1

### Notes on the sheet
- Title
- Engineer
- Revision
- Drawn By
- Checked By
- Date
- Sheet
- of

### Library data of the parts
F5-F8 = 0ZCJ0020FF2E: PTC Resettable Fuse, 0.2A, 30V, SMD 1206; Manufacturer: Bell Fuse; Manufacturer P/N: 0ZCJ0020FF2E
J10 = Header 8: Through-hole Shrouded Header 8-Position; Manufacturer: JST; Manufacturer P/N: B8B-ZR(LF)(SN)
Q9 = DMC2038LVT: Complementary MOSFET Pair; Manufacturer: Diodes, Inc.; Manufacturer P/N: DMC2038LVT
R99 R100 = RES: Thick Film Resistor 10k ±1% 0.1W 50V 0402; Manufacturer: Panasonic; Tcr: ±100; Tr: -55:155; Voltage: 50; Power: 0.1; Manufacturer P/N: ERJ-2RKF1002X; Tolerance: ±1%; Alternatives: *; Footprint: *; Package: 0402